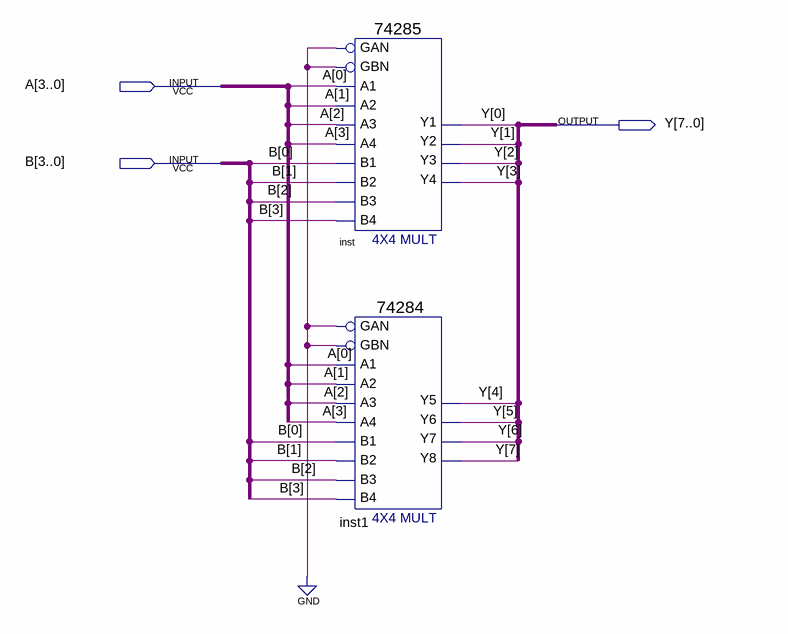
[diagram p0: schematic sheet]
// Quartus schematic MUL.bdf as structural Verilog: 2 symbols, 3 pins
module MUL (
  input  [3:0] A,
  input  [3:0] B,
  output [7:0] Y
);

  \74285  inst (
    .GBN(1'b0), .GAN(1'b0), .A1(A[0]), .A2(A[1]), .A3(A[2]), .B2(B[1]), .B1(B[0]), .A4(A[3]), .B4(B[3]),
    .B3(B[2]), .Y4(Y[3]), .Y1(Y[0]), .Y2(Y[1]), .Y3(Y[2]));
  \74284  inst1 (
    .GAN(1'b0), .A2(A[1]), .A1(A[0]), .GBN(1'b0), .B1(B[0]), .A4(A[3]), .A3(A[2]), .B4(B[3]), .B3(B[2]),
    .B2(B[1]), .Y8(Y[7]), .Y6(Y[5]), .Y7(Y[6]), .Y5(Y[4]));
endmodule
